# Altium schematic sheet ao.SchDoc
size A3; SheetNumber: 2; SheetTotal: 2
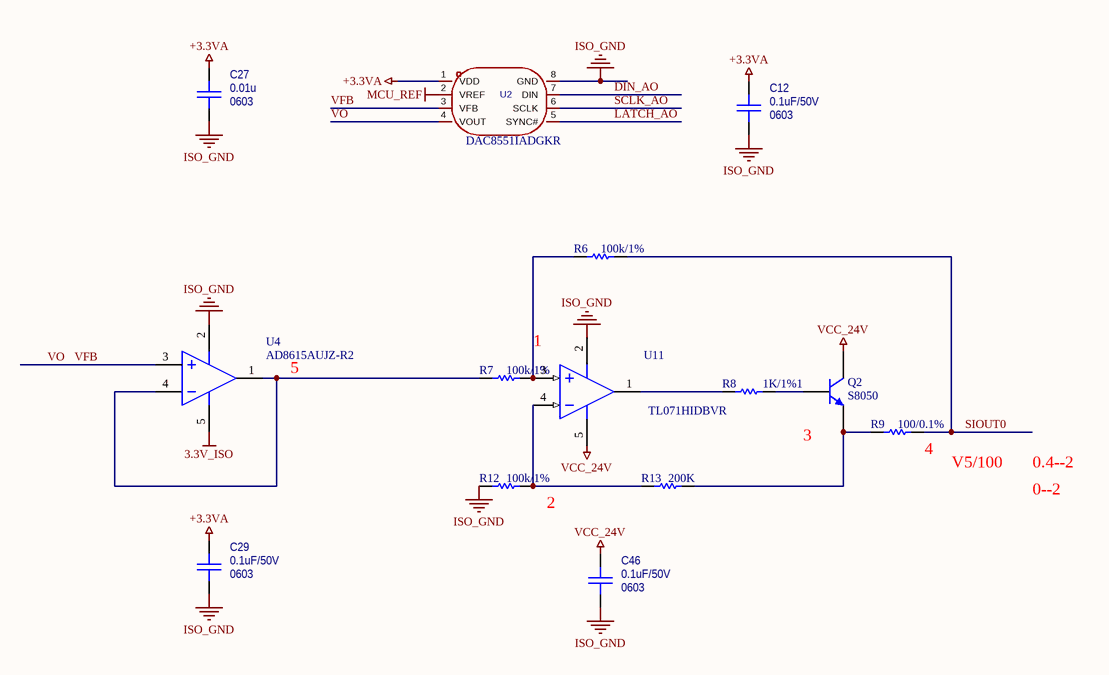
[diagram p0: ao.SchDoc]

## Parts
C12  Package: 0603  [0603C]  (hidden comment: 0.1uF/50V)
C27  value 0.01u  Package: 0603  [0603C]  (hidden comment: 0.01uF/50V)
C29  Package: 0603  [0603C]  (hidden comment: 0.1uF/50V)
C46  Package: 0603  [0603C]  (hidden comment: 0.1uF/50V)
Q2  S8050  [SOT23-3]
R6  100k/1%  [0603R]
R7  100k/1%  [0603R]
R8  1K/1%1  [0603R]
R9  100/0.1%  [0603R]
R12  100k/1%  [0603R]
R13  200K  [0603R]
U2  DAC8551IADGKR  [VSSOP-8_L3.0-W3.0-P0.65-LS5.0-BL]
U4  AD8615AUJZ-R2  [sot-23-5]
U11  TL071HIDBVR  [DBV0005A_M]

## Nets
3.3V_ISO: U4.5(VCC)
+3.3VA: C12.1 C27.1 C29.1 U2.1(VDD)
ISO_GND: C12.2 C27.2 C29.2 C46.2 R12.1 U2.8(GND) U4.2(G) U11.2(V-)
MCU_REF: U2.2(VREF)
VCC_24V: C46.1 Q2.3(C) U11.5(V+)
DIN_AO: U2.7(DIN)
LATCH_AO: U2.5(SYNC#)
SCLK_AO: U2.6(SCLK)
SIOUT0: R6.2 R9.2
VFB: U2.3(VFB) U2.4(VOUT) U4.3(V+)  [also labelled VO]
NetQ2_1: Q2.1(B) R8.1
NetQ2_2: Q2.2(E) R9.1 R13.2
NetR6_1: R6.1 R7.2 U11.3(IN+)
NetR7_1: R7.1 U4.1(OS_NUL) U4.4(V-)
NetR8_2: R8.2 U11.1(OUT)
NetR12_2: R12.2 R13.1 U11.4(IN-)

## Notes on the sheet
- 1
- 5
- (near Q2) 3
- (near R9) 4
- (near R9) V5/100
- 0.4--2
- 0--2
- (near R12) 2

## Library data of the parts
C12 C27 C29 C46 = Capacitor_0603: Capacitor, MLCC; Voltage Rating: [voltage]
  C12 C29 C46: Value: 0.1uF/50V
Q2 = NPN: NPN Bipolar Transistor; Package: SOT23-3
R6-R9 R12 R13 = Res1: Resistor; Package: 0603
U4 = AD8615: Package: sot-23-5
U11 = TL071HIDBVR: Low-Noise FET-Input Operational Amplifier, 4.5 V to 40 V,  -40 to 125 degC, 5-Pin SOT-23 (DBV), Green (RoHS & no Sb/Br), Tape and Reel; Value: TL071HIDBVR; Package: DBV0005A_M
U2 = DAC8551IADGKR: Package: VSSOP-8_L3.0-W3.0-P0.65-LS5.0-BL